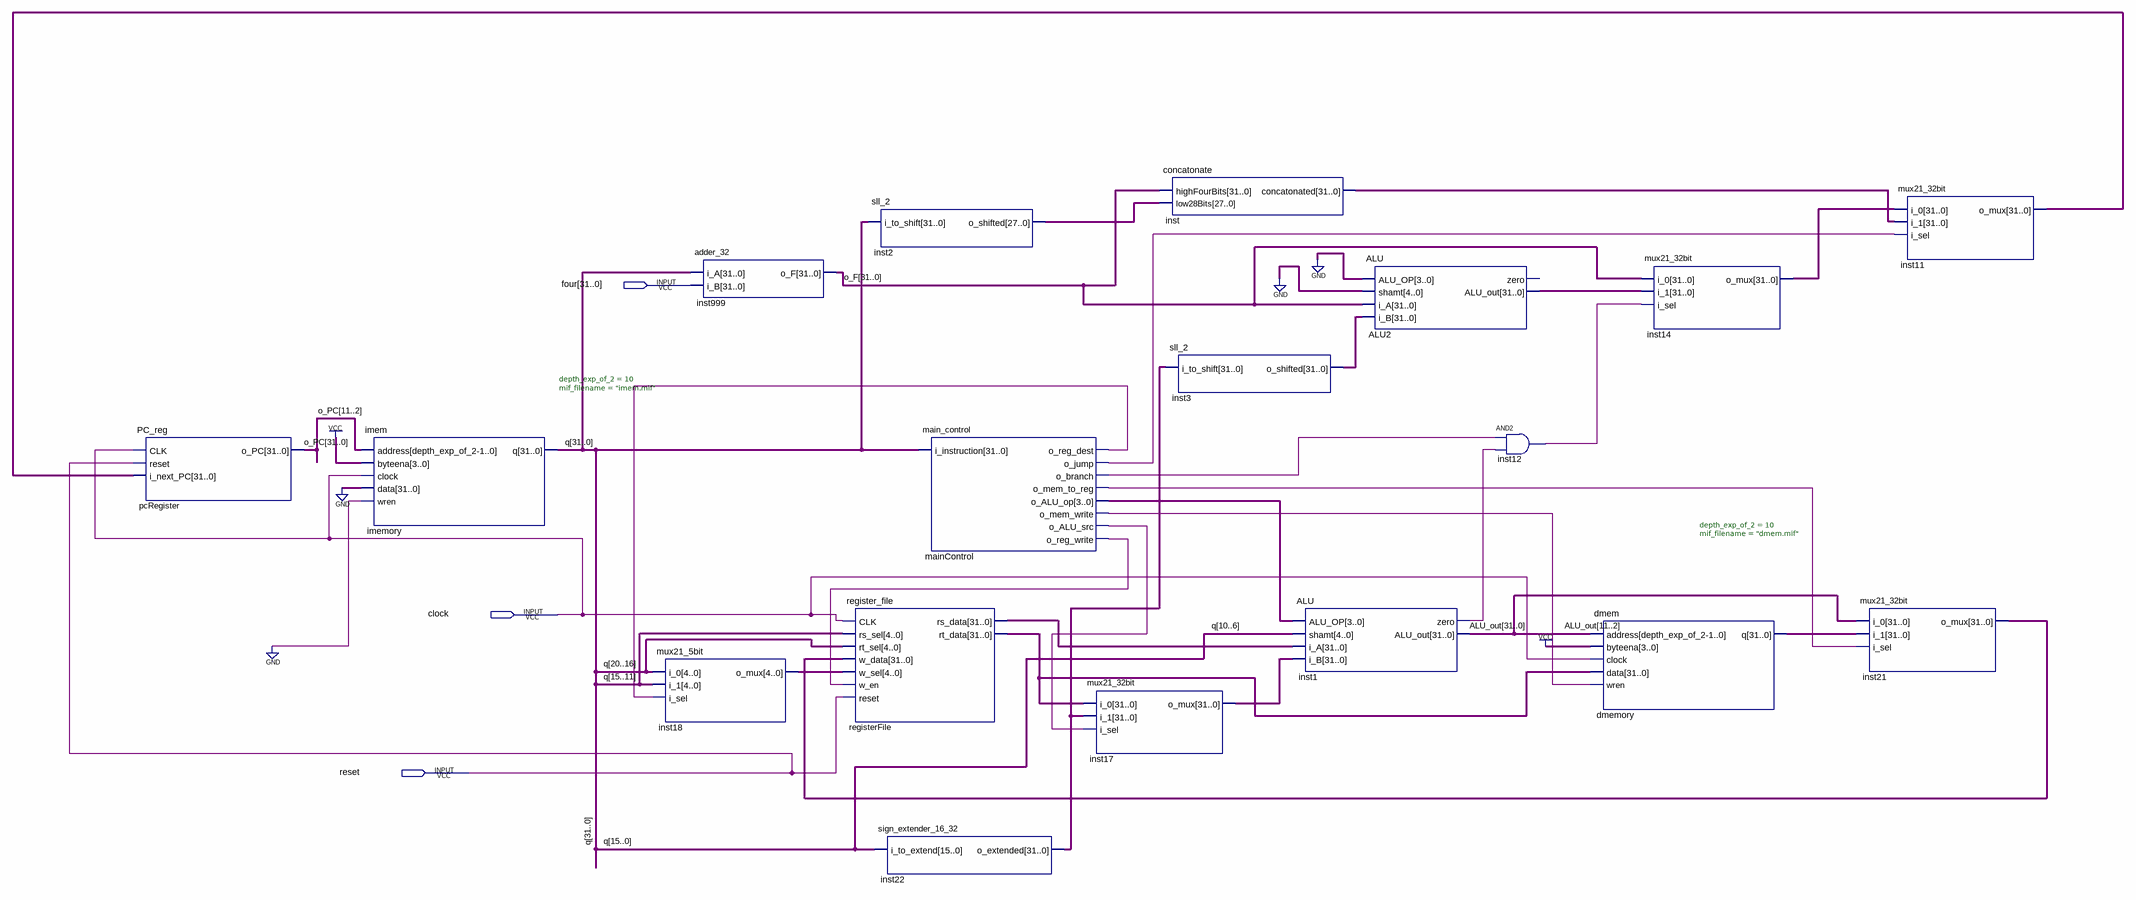
[diagram p0: schematic sheet]
// Quartus schematic projectA.bdf as structural Verilog: 18 symbols, 3 pins
module projectA (
  input  [31:0] four,
  input  clock,
  input  reset
);

  wire inst1_zero, inst12_out, mainControl_o_alu_src, mainControl_o_branch, mainControl_o_jump,
       mainControl_o_mem_to_reg, mainControl_o_mem_write, mainControl_o_reg_dest, mainControl_o_reg_write;
  wire [3:0] mainControl_o_alu_op;
  wire [4:0] inst18_o_mux;
  wire [27:0] inst2_o_shifted;
  wire [31:0] ALU2_alu_out, ALU_out, dmemory_q, inst3_o_shifted, inst11_o_mux, inst14_o_mux, inst17_o_mux,
       inst21_o_mux, inst22_o_extended, inst_concatonated, o_F, o_PC, q, registerFile_rs_data,
       registerFile_rt_data;

  PC_reg pcRegister (.CLK(clock), .reset(reset), .i_next_PC(inst11_o_mux), .o_PC(o_PC));
  imem #(.depth_exp_of_2(10), .mif_filename("imem.mif")) imemory (
    .address(o_PC[11:2]), .byteena(4'b1111), .clock(clock), .data({32{1'b0}}), .wren(1'b0), .q(q));
  mux21_5bit inst18 (.i_0(q[20:16]), .i_1(q[15:11]), .i_sel(mainControl_o_reg_dest), .o_mux(inst18_o_mux));
  adder_32 inst999 (.i_A(q), .i_B(four), .o_F(o_F));
  sll_2 inst2 (.i_to_shift(q), .o_shifted(inst2_o_shifted));
  register_file registerFile (
    .CLK(clock), .rs_sel(q[15:11]), .rt_sel(q[20:16]), .w_data(inst21_o_mux), .w_sel(inst18_o_mux),
    .w_en(mainControl_o_reg_write), .reset(reset), .rs_data(registerFile_rs_data),
    .rt_data(registerFile_rt_data));
  sign_extender_16_32 inst22 (.i_to_extend(q[15:0]), .o_extended(inst22_o_extended));
  main_control mainControl (
    .i_instruction(q), .o_reg_dest(mainControl_o_reg_dest), .o_jump(mainControl_o_jump),
    .o_branch(mainControl_o_branch), .o_mem_to_reg(mainControl_o_mem_to_reg),
    .o_ALU_op(mainControl_o_alu_op), .o_mem_write(mainControl_o_mem_write),
    .o_ALU_src(mainControl_o_alu_src), .o_reg_write(mainControl_o_reg_write));
  mux21_32bit inst17 (
    .i_0(registerFile_rt_data), .i_1(inst22_o_extended), .i_sel(mainControl_o_alu_src), .o_mux(inst17_o_mux));
  concatonate inst (.highFourBits(o_F), .low28Bits(inst2_o_shifted), .concatonated(inst_concatonated));
  sll_2 inst3 (.i_to_shift(inst22_o_extended), .o_shifted(inst3_o_shifted));
  ALU inst1 (
    .ALU_OP(mainControl_o_alu_op), .shamt(q[10:6]), .i_A(registerFile_rs_data), .i_B(inst17_o_mux),
    .zero(inst1_zero), .ALU_out(ALU_out));
  ALU ALU2 (
    .ALU_OP(4'b0000), .shamt({5{1'b0}}), .i_A(o_F), .i_B(inst3_o_shifted), .ALU_out(ALU2_alu_out));  // open: zero
  and inst12 (inst12_out, mainControl_o_branch, inst1_zero);
  dmem #(.depth_exp_of_2(10), .mif_filename("dmem.mif")) dmemory (
    .address(ALU_out[11:2]), .byteena(4'b1111), .clock(clock), .data(registerFile_rt_data),
    .wren(mainControl_o_mem_write), .q(dmemory_q));
  mux21_32bit inst14 (.i_0(o_F), .i_1(ALU2_alu_out), .i_sel(inst12_out), .o_mux(inst14_o_mux));
  mux21_32bit inst21 (.i_0(ALU_out), .i_1(dmemory_q), .i_sel(mainControl_o_mem_to_reg), .o_mux(inst21_o_mux));
  mux21_32bit inst11 (.i_0(inst14_o_mux), .i_1(inst_concatonated), .i_sel(mainControl_o_jump), .o_mux(inst11_o_mux));
endmodule
